# EAGLE schematic ADS124S08 (EAGLE 9.1.1)
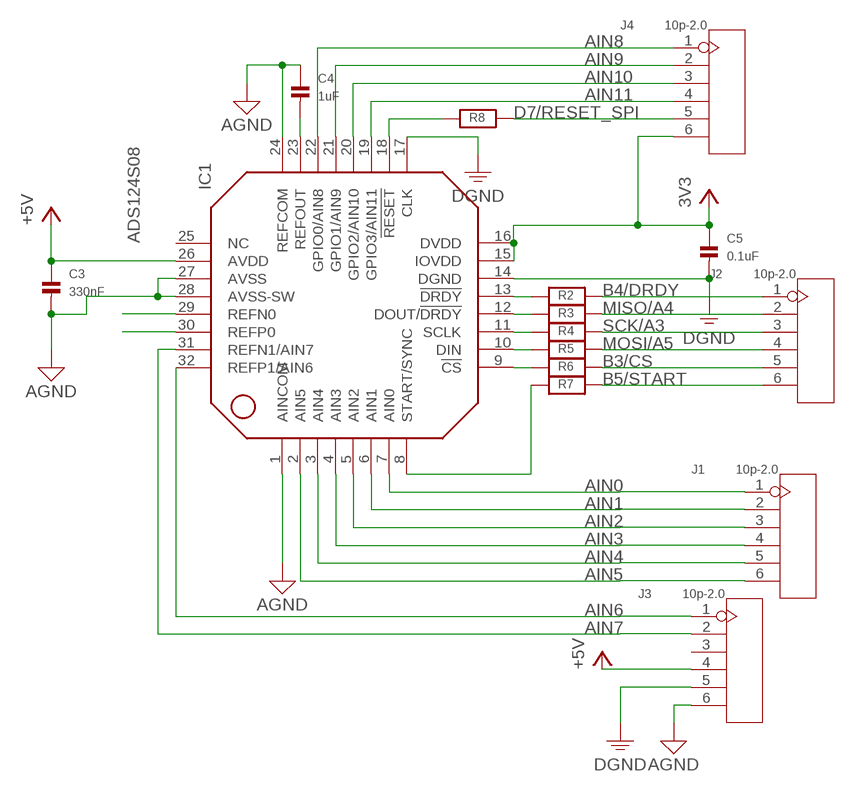
[diagram p0: schematic, sheet 1]

## Parts
C3  330nF  CAP_CERAMIC0805  [0805]
C4  1uF  CAP_CERAMIC0805  [0805]
C5  0.1uF  CAP_CERAMIC0805  [0805]
IC1  ADS124S08  [ADS124S08]
J1  10p-2.0  DIP-BLACK-FEMALE-HEADER-VERT(10P-2.0)  [H10-2.0]
J2  10p-2.0  DIP-BLACK-FEMALE-HEADER-VERT(10P-2.0)  [H10-2.0]
J3  10p-2.0  DIP-BLACK-FEMALE-HEADER-VERT(10P-2.0)  [H10-2.0]
J4  10p-2.0  DIP-BLACK-FEMALE-HEADER-VERT(10P-2.0)  [H10-2.0]
R2  47  RESISTOR0603  [0603]
R3  47  RESISTOR0603  [0603]
R4  47  RESISTOR0603  [0603]
R5  47  RESISTOR0603  [0603]
R6  RESISTOR0603  [0603]
R7  47  RESISTOR0603  [0603]
R8  47  RESISTOR0603  [0603]

## Nets
3V3: C5.1 IC1.15(IOVDD) IC1.16(DVDD) J4.6
!RESET: IC1.18(!RESET) R8.1
+5V: C3.1 IC1.26(AVDD) J3.4
AGND: C3.2 C4.1 IC1.1(AINCOM) IC1.24(REFCOM) IC1.27(AVSS) IC1.28(AVSS-SW) J3.6
AIN0: IC1.7(AIN0) J1.1
AIN1: IC1.6(AIN1) J1.2
AIN2: IC1.5(AIN2) J1.3
AIN3: IC1.4(AIN3) J1.4
AIN4: IC1.3(AIN4) J1.5
AIN5: IC1.2(AIN5) J1.6
AIN6: IC1.32(REFP1/AIN6) J3.1
AIN7: IC1.31(REFN1/AIN7) J3.2
AIN8: IC1.22(GPIO0/AIN8) J4.1
AIN9: IC1.21(GPIO1/AIN9) J4.2
AIN10: IC1.20(GPIO2/AIN10) J4.3
AIN11: IC1.19(GPIO3/AIN11) J4.4
B3/CS: J2.5 R6.2
B4/DRDY: J2.1 R2.2
B5/START: J2.6 R7.2
CS: IC1.9(!CS) R6.1
D7/RESET_SPI: J4.5 R8.2
DGND: C5.2 IC1.14(DGND) IC1.17(CLK) J3.5
DRDY: IC1.13(!DRDY) R2.1
MISO: IC1.12(DOUT/!DRDY) R3.1
MISO/A4: J2.2 R3.2
MOSI: IC1.10(DIN) R5.1
MOSI/A5: J2.4 R5.2
N$3: IC1.29(REFN0)
N$4: IC1.30(REFP0)
REFOUT: C4.2 IC1.23(REFOUT)
SCK: IC1.11(SCLK) R4.1
SCK/A3: J2.3 R4.2
START: IC1.8(START/SYNC) R7.1
Unconnected: IC1.25(NC) J3.3

## Library data of the parts
C3-C5 = microbuilder:CAP_CERAMIC: Ceramic Capacitors 0402 - 0402 Surface Mount Capacitors 16pF 50V 5% [Digikey: 445-4899-2-ND] 18pF 50V 5% [Digikey: 490-1281-2-ND] 22pF 50V 5% [Digikey: 490-1283-2-ND] 68pF 50V 5% [Digikey: 490-1289-2-ND] 0.1uF 10V 10% [Digikey: 490-1318-2-ND] 1.0uF 6.3V 10% [Digikey: 490-1320-2-ND] 0603 - 0603 Surface Mount Capacitors 16 pF 50V 5% [Digikey: 445-5051-2-ND] 22 pF 50V [Digikey: PCC220ACVTR-ND] 33 pF 50V 5% [Digikey: 490-1415-1-ND] 56pF 50V 5% [Digikey: 490-1421-1-ND] 220pF 50V 5% [Digikey: 445-1285-1-ND] 680 pF 50V 2200 pF 50V 5% C0G [Digikey: 445-1297-1-ND] 5600 pF 100V 5% X7R [Digikey: 478-3711-1-ND] 0.1 µF 25V 10% [Digikey: PCC2277TR-ND] 0.22 µF 16V 10% X7R [Digikey: 445-1318-1-ND] 1.0 µF 25V 10% [Digikey: 445-5146-2-ND] 0603 - RF Specific 3pF 250V +/-0.1pF RF [Digikey: 712-1347-1-ND] 18 pF 250V 5% [Digikey: 478-3505-1-ND or 712-1322-1-ND] 56 pF 250V 5% C0G RF [Digikey: 490-4867-1-ND] 68 pF 250V RF [Digikey: 490-4868-1-ND] 0805 - 0805 Surface Mount Capacitors 220 pF 250V 2% RF Ceramic Capacitor [Digikey: 712-1398-1-ND] 1000 pF 50V 2% NP0 Ceramic Capacitor [Digikey: 478-3760-1-ND] 0.1 µF 25V 10% Ceramic Capacitor [Digikey: PCC1828TR-ND] 1.0 µF 16V 10% Ceramic Capacitor[Digikey: 490-1691-2-ND] 10.0 µF 10V 10% Ceramic Capacitor[Digikey: 709-1228-1-ND] 10.0 uF 16V 10% Ceramic Capacitor [Digikey: 478-5165-2-ND] 47 uF 6.3V 20% Ceramic Capacitor [Digikey: 587-1779-1-ND or 399-5506-1-ND] 1206 - 1206 Surface Mount Capacitors 47uF 10V 20% Ceramic Capacitor [Digikey: 490-5528-1-ND or 399-5508-1-ND or 445-6010-1-ND] 100uF 6.3V -20%, +80% Y5V Ceramic Capacitor (Digikey: 490-4512-1-ND, Mouser: 81-GRM31CF50J107ZE1L); MF: AVX; MPN: 08055C104JAT2A; OC_FARNELL: 1740673
IC1 = OIZOM:ADS124S08: Fast Ethernet Controller with PHY, MAC and SPI; OC_FARNELL: unknown
J1-J4 = OIZOM:DIP-BLACK-FEMALE-HEADER-VERT(10P-2.0): 320030009; MPN: F243-1110A1BSUA1
R2-R8 = microbuilder:RESISTOR: Resistors 0402 - 0402 Surface Mount Package 22 Ohm 1% 1/16W [Digikey: 311-22.0LRTR-ND] 33 Ohm 5% 1/16W 1.0K 5% 1/16W 1.5K 5% 1/16W 2.0K 1% 1/16W 10.0K 1% 1/16W [Digikey: 311-10.0KLRTR-ND] 10.0K 5% 1/16W [Digikey: RMCF0402JT10K0TR-ND] 12.1K 1% 1/16W [Digikey: 311-22.0LRTR-ND] 100.0K 5% 1/16W 0603 - 0603 Surface Mount Package 0 Ohm 1/10 Watt 1% Resistor 15 Ohm 1/10 Watt 1% Resistor 33 Ohm 1/10 Watt 1% Resistor 49.9 Ohm 1/10 Watt 1% Resistor 100 Ohm 1/10 Watt 1% Resistor 150 Ohm 1/10 Watt 1% Resistor 240 Ohm 1/10 Watt 1% Resistor 390 Ohm 1/10 Watt 1% Resistor 560 Ohm 1/10 Watt 1% Resistor 680 Ohm 1/10 Watt 1% Resistor 750 Ohm 1/10 Watt 1% Resistor 1.0K Ohm 1/10 Watt 1% Resistor 1.5K Ohm 1/10 Watt 1% Resistor 2.0K Ohm 1/10 Watt 1% Resistor 2.2K Ohm 1/10 Watt 1% Resistor 3.3K Ohm 1/10 Watt 1% Resistor 4.7K Ohm 1/10 Watt 1% Resistor 10.0K Ohm 1/10 Watt 1% Resistor 12.0K Ohm 1/10 Watt 1% Resistor 12.1K Ohm 1/10 Watt 1% Resistor 20.0K Ohm 1/10 Watt 1% Resistor 33.0K Ohm 1/10 Watt 1% Resistor 100.0K Ohm 1/10 Watt 1% Resistor 0805 - 0805 Surface Mount Package 0 Ohm 1/8 Watt 1% Resistor 33 Ohm 1/8 Watt 1% Resistor 100 Ohm 1/8 Watt 1% Resistor 150 Ohm 1/8 Watt 1% Resistor 200 Ohm 1/8 Watt 1% Resistor 240 Ohm 1/8 Watt 1% Resistor 330 Ohm 1/8 Watt 1% Resistor 390 Ohm 1/8 Watt 1% Resistor 470 Ohm 1/8 Watt 1% Resistor 1.0K Ohm 1/8 Watt 1% Resistor 1.5K Ohm 1/8 Watt 1% Resistor 2.0K Ohm 1/8 Watt 1% Resistor 4.7K Ohm 1/8 Watt 1% Resistor 5.1K Ohm 1/8 Watt 1% Resistor 5.6K Ohm 1/8 Watt 1% Resistor 10.0K Ohm 1/8 Watt 1% Resistor 22.0K Ohm 1/8 Watt 1% Resistor 33.0K Ohm 1/8 Watt 1% Resistor 100K Ohm 1/8 Watt 1% Resistor 1206 - 1206 Surface Mount Package 2012 - 2010 Surface Mount Package 0.11 Ohm 1/2 Watt 1% Resistor - Digikey: RHM.11UCT-ND; OC_FARNELL: unknown